# Altium schematic sheet 专利总体电路图_连接后.SCHDOC
size A4
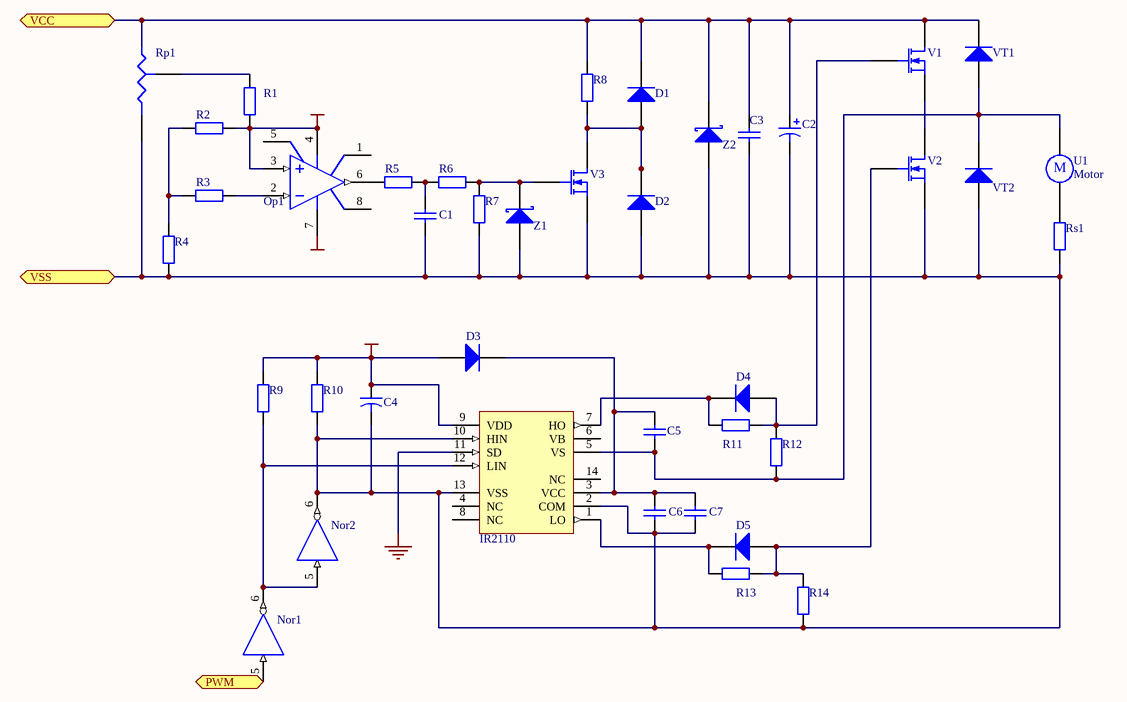
[diagram p0: 专利总体电路图_连接后.SCHDOC]

## Parts
(Parts that share a designator on the sheet are numbered #1, #2 ... from top to bottom, then left to right.)
?#1  Z2  [SO-G3/C2.5]
?#2  Motor  [RB5-10.5]
?#3  VT2  [DIO18.84-9.6x5.6]
?#4  Z1  [SO-G3/C2.5]
?#5  IR2110  [PDIP14]
?#6  Nor2  [FK020D]  (part A of 6)
C1  (no value)  [CAPR2.54-5.1X3.2]
C2  (no value)  [CAPPA14.05-10.5x6.3]
C3  (no value)  [CAPR2.54-5.1X3.2]
C4  (no value)  [CAPR5-4X5]
C5  (no value)  [CAPR2.54-5.1X3.2]
C6  (no value)  [CAPR2.54-5.1X3.2]
C7  (no value)  [CAPR2.54-5.1X3.2]
D1  (no value)  [DIO18.84-9.6x5.6]
D2  (no value)  [DSO-C2/X3.3]
D3  (no value)  [DSO-C2/X3.3]
D4  (no value)  [DSO-C2/X3.3]
D5  (no value)  [DSO-C2/X3.3]
Nor1  Nor1  [FK020D]  (part A of 6)
Op1  (no value)  [CAN-8/D9.4]
R1  (no value)  [AXIAL-0.5]
R2  (no value)  [AXIAL-0.5]
R3  (no value)  [AXIAL-0.5]
R4  (no value)  [AXIAL-0.5]
R5  (no value)  [AXIAL-0.5]
R6  (no value)  [AXIAL-0.5]
R7  (no value)  [AXIAL-0.5]
R8  (no value)  [AXIAL-0.5]
R9  (no value)  [AXIAL-0.5]
R10  (no value)  [AXIAL-0.5]
R11  (no value)  [AXIAL-0.5]
R12  (no value)  [AXIAL-0.5]
R13  (no value)  [AXIAL-0.5]
R14  (no value)  [AXIAL-0.5]
Rp1  (no value)  [VR3]
Rs1  (no value)  [AXIAL-0.4]
V1  (no value)  [BCY-W3/H.8]
V2  (no value)  [BCY-W3/H.8]
V3  (no value)  [BCY-W3/H.8]
VT1  (no value)  [DIO18.84-9.6x5.6]

## Ports
PWM, VCC, VSS

## Nets
+15V: ?#5.9(VDD) C4.1 D3.1(A) Op1.3(IN+) Op1.4(V-) R1.1 R2.1 R9.2 R10.2
-15V: Op1.7(V+)
GND: ?#6.9(GND) ?#6.10(GND) ?#6.11(GND) ?#6.12(GND) Nor1.9(GND) Nor1.10(GND) Nor1.11(GND) Nor1.12(GND)
VCC: ?#5.11(SD) ?#6.1(VCC) ?#6.20(VCC) Nor1.1(VCC) Nor1.20(VCC)
PWM: Nor1.5(A) ; port PWM
VCC: ?#1.3(K) C2.1 C3.2 D1.2(K) R8.2 Rp1.1(A) V1.1(D) VT1.2(K) ; port VCC  [a separate net that carries the same name]
VSS: ?#1.1(A) ?#3.1(A) ?#4.1(A) ?#5.2(COM) ?#5.10(HIN) ?#5.13(VSS) ?#6.6(Y) C1.1 C2.2 C3.1 C4.2 C6.1 C7.1 D2.1(A) R4.2 R7.1 R10.1 R14.1 Rp1.2(B) Rs1.1 V2.3(S) V3.3(S) ; port VSS
Net?#2_1: ?#2.1 ?#3.2(K) ?#5.5(VS) C5.1 R12.1 VT1.1(A)
Net?#2_2: ?#2.2 Rs1.2
Net?#4_3: ?#4.3(K) R6.2 R7.2 V3.2(G)
Net?#5_1: ?#5.1(LO) D5.2(K) R13.2
Net?#5_3: ?#5.3(VCC) C5.2 C6.2 C7.2 D3.2(K)
Net?#5_7: ?#5.7(HO) D4.2(K) R11.1
Net?#5_12: ?#5.12(LIN) ?#6.5(A) Nor1.6(Y) R9.1
NetC1_2: C1.2 R5.2 R6.1
NetD1_1: D1.1(A) D2.2(K) R8.1 V3.1(D)
NetD4_1: D4.1(A) R11.2 R12.2 V1.2(G)
NetD5_1: D5.1(A) R13.1 R14.2 V2.2(G)
NetOp1_2: Op1.2(IN-) R3.1
NetOp1_6: Op1.6(OUT) R5.1
NetR1_2: R1.2 Rp1.3(TAP)
NetR2_2: R2.2 R3.2 R4.1
NetV1_3: V1.3(S) V2.1(D)

Not connected (* = marked no-connect by the designer): ?#5 4(NC) 6(VB) 8(NC) 14(NC); Op1 1(OS_NUL) 5(OS_NUL) 8(TAB)

## Notes on the sheet
- U1
- (in symbol Motor) M

## Library data of the parts
?#1 ?#4 = Diode BAS70: Silicon AF Schottky Diode for High-Speed Switching; Package Information: Latest Revision: Sep-2001; Note: Pin 2 is not connected and not drawn.; Published: 21-Mar-2003; Datasheet: Latest Revision: Oct-1999; Package Reference: SOT-23; Publisher: Altium Limited
?#2 = Motor: Motor, General Kind; Published: 24-Mar-1999; Revision: July-2002: Re-released for DXP Platform.; Publisher: Altium Limited
?#3 D1 VT1 = Diode 1N5408: 3 Amp Medium Power Silicon Rectifier Diode; Revision 1: 10-Jul-2000: SIM Model Added.; Revision 2: 17-Jul-2002: Re-released for DXP Platform.; Published: 8-Jun-2000; Datasheet: Latest Revision: Aug-1984; Package Reference: DO-201AD; Publisher: Altium Limited
?#5 = IR2110: High and Low Side Driver; Note: Pins 4, 8 and 14 are not connected; Published: 8-Jun-2000; Revision: 17-Jul-2002: Re-released for DXP Platform.; Datasheet: Latest Revision: PD60147J; Package Reference: PDIP14; Publisher: Altium Limited
?#6 Nor1 = 54AC11004FK: Hex Inverter; Package Information: Latest Revision: 1998; Note: Pins 2 and 19 are not connected and not drawn; Published: 8-Jun-2000; Revision: 17-Jul-2002: Re-released for DXP Platform.; Datasheet: 1990 Advanced CMOS Logic Data Book (Mar-1990); Package Reference: FK020D; Publisher: Altium Limited
C1 = cap: Capacitor; Value: 100pF; Published: 8-Jun-2000; Revision: July-2002: Re-released for DXP Platform.; Publisher: Altium Limited
C2 = Cap Pol2: Polarized Capacitor (Axial); Value: 100pF; Published: 8-Jun-2000; Revision: July-2002: Re-released for DXP Platform.; Publisher: Altium Limited
C3 = cap: Capacitor; Published: 8-Jun-2000; Revision: July-2002: Re-released for DXP Platform.; Publisher: Altium Limited
C4 = Cap2: Capacitor; Value: 10uf; Published: 23-Sep-2002; Publisher: Altium Limited
C5 C6 = Cap: Capacitor; Value: 10uF; Published: 8-Jun-2000; Revision: July-2002: Re-released for DXP Platform.; Publisher: Altium Limited
C7 = Cap: Capacitor; Value: 0.47uf; Published: 8-Jun-2000; Revision: July-2002: Re-released for DXP Platform.; Publisher: Altium Limited
D2 = diode: Default Diode; Code - JEDEC: DO-214-AB; Published: 8-Jun-2000; Revision: July-2002: Re-released for DXP Platform.; Publisher: Altium Limited
D3-D5 = Diode: Default Diode; Code - JEDEC: DO-214-AB; Published: 8-Jun-2000; Revision: July-2002: Re-released for DXP Platform.; Publisher: Altium Limited
Op1 = Op Amp: FET Operational Amplifier; Published: 8-Jun-2000; Revision: July-2002: Re-released for DXP Platform.; Datasheet: Latest Revision: REV. B; Package Reference: H-08A; Publisher: Altium Limited
R1 R8 = Res Semi: Semiconductor Resistor; Value: 1K; Published: 8-Jun-2000; Revision: July-2002: Re-released for DXP Platform.; Publisher: Altium Limited
R2 R3 = Res Semi: Semiconductor Resistor; Value: 5K; Published: 8-Jun-2000; Revision: July-2002: Re-released for DXP Platform.; Publisher: Altium Limited
R4 R7 R12 R14 = Res Semi: Semiconductor Resistor; Value: 10K; Published: 8-Jun-2000; Revision: July-2002: Re-released for DXP Platform.; Publisher: Altium Limited
R5 = Res Semi: Semiconductor Resistor; Value: 100; Published: 8-Jun-2000; Revision: July-2002: Re-released for DXP Platform.; Publisher: Altium Limited
R6 = Res Semi: Semiconductor Resistor; Value: 220; Published: 8-Jun-2000; Revision: July-2002: Re-released for DXP Platform.; Publisher: Altium Limited
R9 R10 = Res Semi: Semiconductor Resistor; Value: 51K; Published: 8-Jun-2000; Revision: July-2002: Re-released for DXP Platform.; Publisher: Altium Limited
R11 R13 = Res Semi: Semiconductor Resistor; Value: 200; Published: 8-Jun-2000; Revision: July-2002: Re-released for DXP Platform.; Publisher: Altium Limited
Rp1 = Res Tap: Tapped Resistor; Set Position: 0.5; Value: 50K; Published: 24-Mar-1999; Revision: July-2002: Re-released for DXP Platform.; Publisher: Altium Limited
Rs1 = Res2: Resistor; Value: 1K; Published: 8-Jun-2000; Revision: July-2002: Re-released for DXP Platform.; Publisher: Altium Limited
V1-V3 = MOSFET-N: N-Channel MOSFET; Published: 8-Jun-2000; Revision: July-2002: Re-released for DXP Platform.; Publisher: Altium Limited